# EAGLE schematic Button pannel (EAGLE 9.6.2)
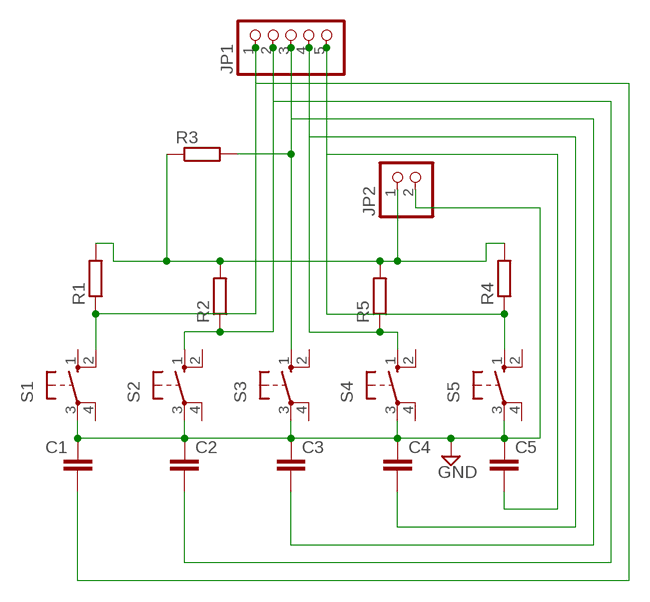
[diagram p0: schematic, sheet 1]

## Parts
C1  C-EU025-025X050  [C025-025X050]
C2  C-EU025-025X050  [C025-025X050]
C3  C-EU025-025X050  [C025-025X050]
C4  C-EU025-025X050  [C025-025X050]
C5  C-EU025-025X050  [C025-025X050]
JP1  PINHD-1X5  [1X05]
JP2  PINHD-1X2  [1X02]
R1  R-EU_0204/7  [0204/7]
R2  R-EU_0204/7  [0204/7]
R3  R-EU_0204/7  [0204/7]
R4  R-EU_0204/7  [0204/7]
R5  R-EU_0204/7  [0204/7]
S1  40-XX  [B3F-40XX]
S2  40-XX  [B3F-40XX]
S3  40-XX  [B3F-40XX]
S4  40-XX  [B3F-40XX]
S5  40-XX  [B3F-40XX]

## Nets
GND: C1.1 C2.1 C3.1 C4.1 C5.1 JP2.2 S1.3(P) S2.3(P) S3.3(P) S4.3(P) S5.3(P)
N$1: C2.2 JP1.2 R2.1 S2.1(S)
N$2: C1.2 JP1.1 R1.1 S1.2(S1)
N$3: C3.2 JP1.3 R3.2 S3.1(S)
N$4: C4.2 JP1.4 R5.1 S4.1(S)
N$5: C5.2 JP1.5 R4.1 S5.1(S)
N$6: JP2.1 R1.2 R2.2 R3.1 R4.2 R5.2
Unconnected: S1.1(S) S1.4(P1) S2.2(S1) S2.4(P1) S3.2(S1) S3.4(P1) S4.2(S1) S4.4(P1) S5.2(S1) S5.4(P1)

## Library data of the parts
C1-C5 = rcl:C-EU: CAPACITOR, European symbol; SPICEPREFIX: C
JP1 = pinhead:PINHD-1X5: PIN HEADER
JP2 = pinhead:PINHD-1X2: PIN HEADER
R1-R5 = rcl:R-EU_: RESISTOR, European symbol; SPICEPREFIX: R
S1-S5 = switch-omron:40-XX: OMRON SWITCH